# Altium schematic sheet POWER-BUDGET.SchDoc
size A4; SheetNumber: 6; SheetTotal: 6
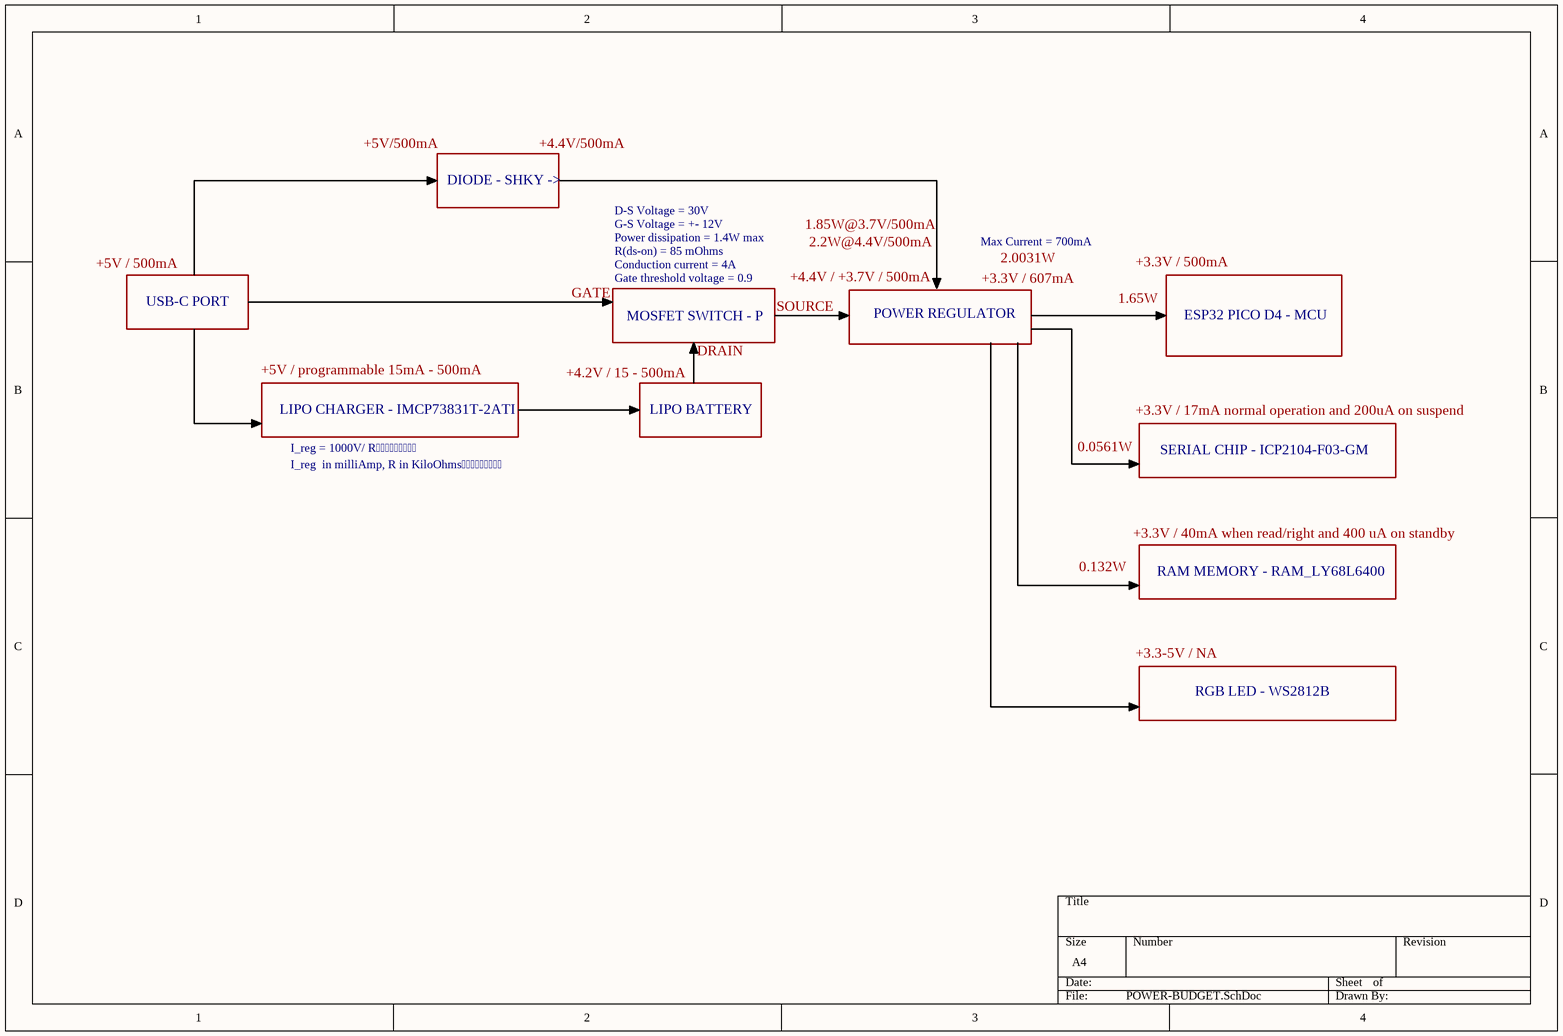
[diagram p0: POWER-BUDGET.SchDoc]

## Notes on the sheet
- +5V/500mA
- +4.4V/500mA
- DIODE - SHKY ->
- Power dissipation = 1.4W max
- G-S Voltage = +- 12V
- D-S Voltage = 30V
- 1.85W@3.7V/500mA
- 2.2W@4.4V/500mA
- Max Current = 700mA
- +5V / 500mA
- USB-C PORT
- GATE
- Gate threshold voltage = 0.9
- Conduction current = 4A
- R(ds-on) = 85 mOhms
- SOURCE
- +4.4V / +3.7V / 500mA
- +3.3V / 607mA
- 2.0031W
- 1.65W
- +3.3V / 500mA
- +5V / programmable 15mA - 500mA
- +4.2V / 15 - 500mA
- MOSFET SWITCH - P
- DRAIN
- POWER REGULATOR
- ESP32 PICO D4 - MCU
- LIPO CHARGER - IMCP73831T-2ATI
- I_reg = 1000V/ R
- LIPO BATTERY
- 0.0561W
- +3.3V / 17mA normal operation and 200uA on suspend
- I_reg  in milliAmp, R in KiloOhms
- SERIAL CHIP - ICP2104-F03-GM
- 0.132W
- +3.3V / 40mA when read/right and 400 uA on standby
- RAM MEMORY - RAM_LY68L6400
- +3.3-5V / NA
- RGB LED - WS2812B